# EAGLE design CANoPi (EAGLE 6.3)
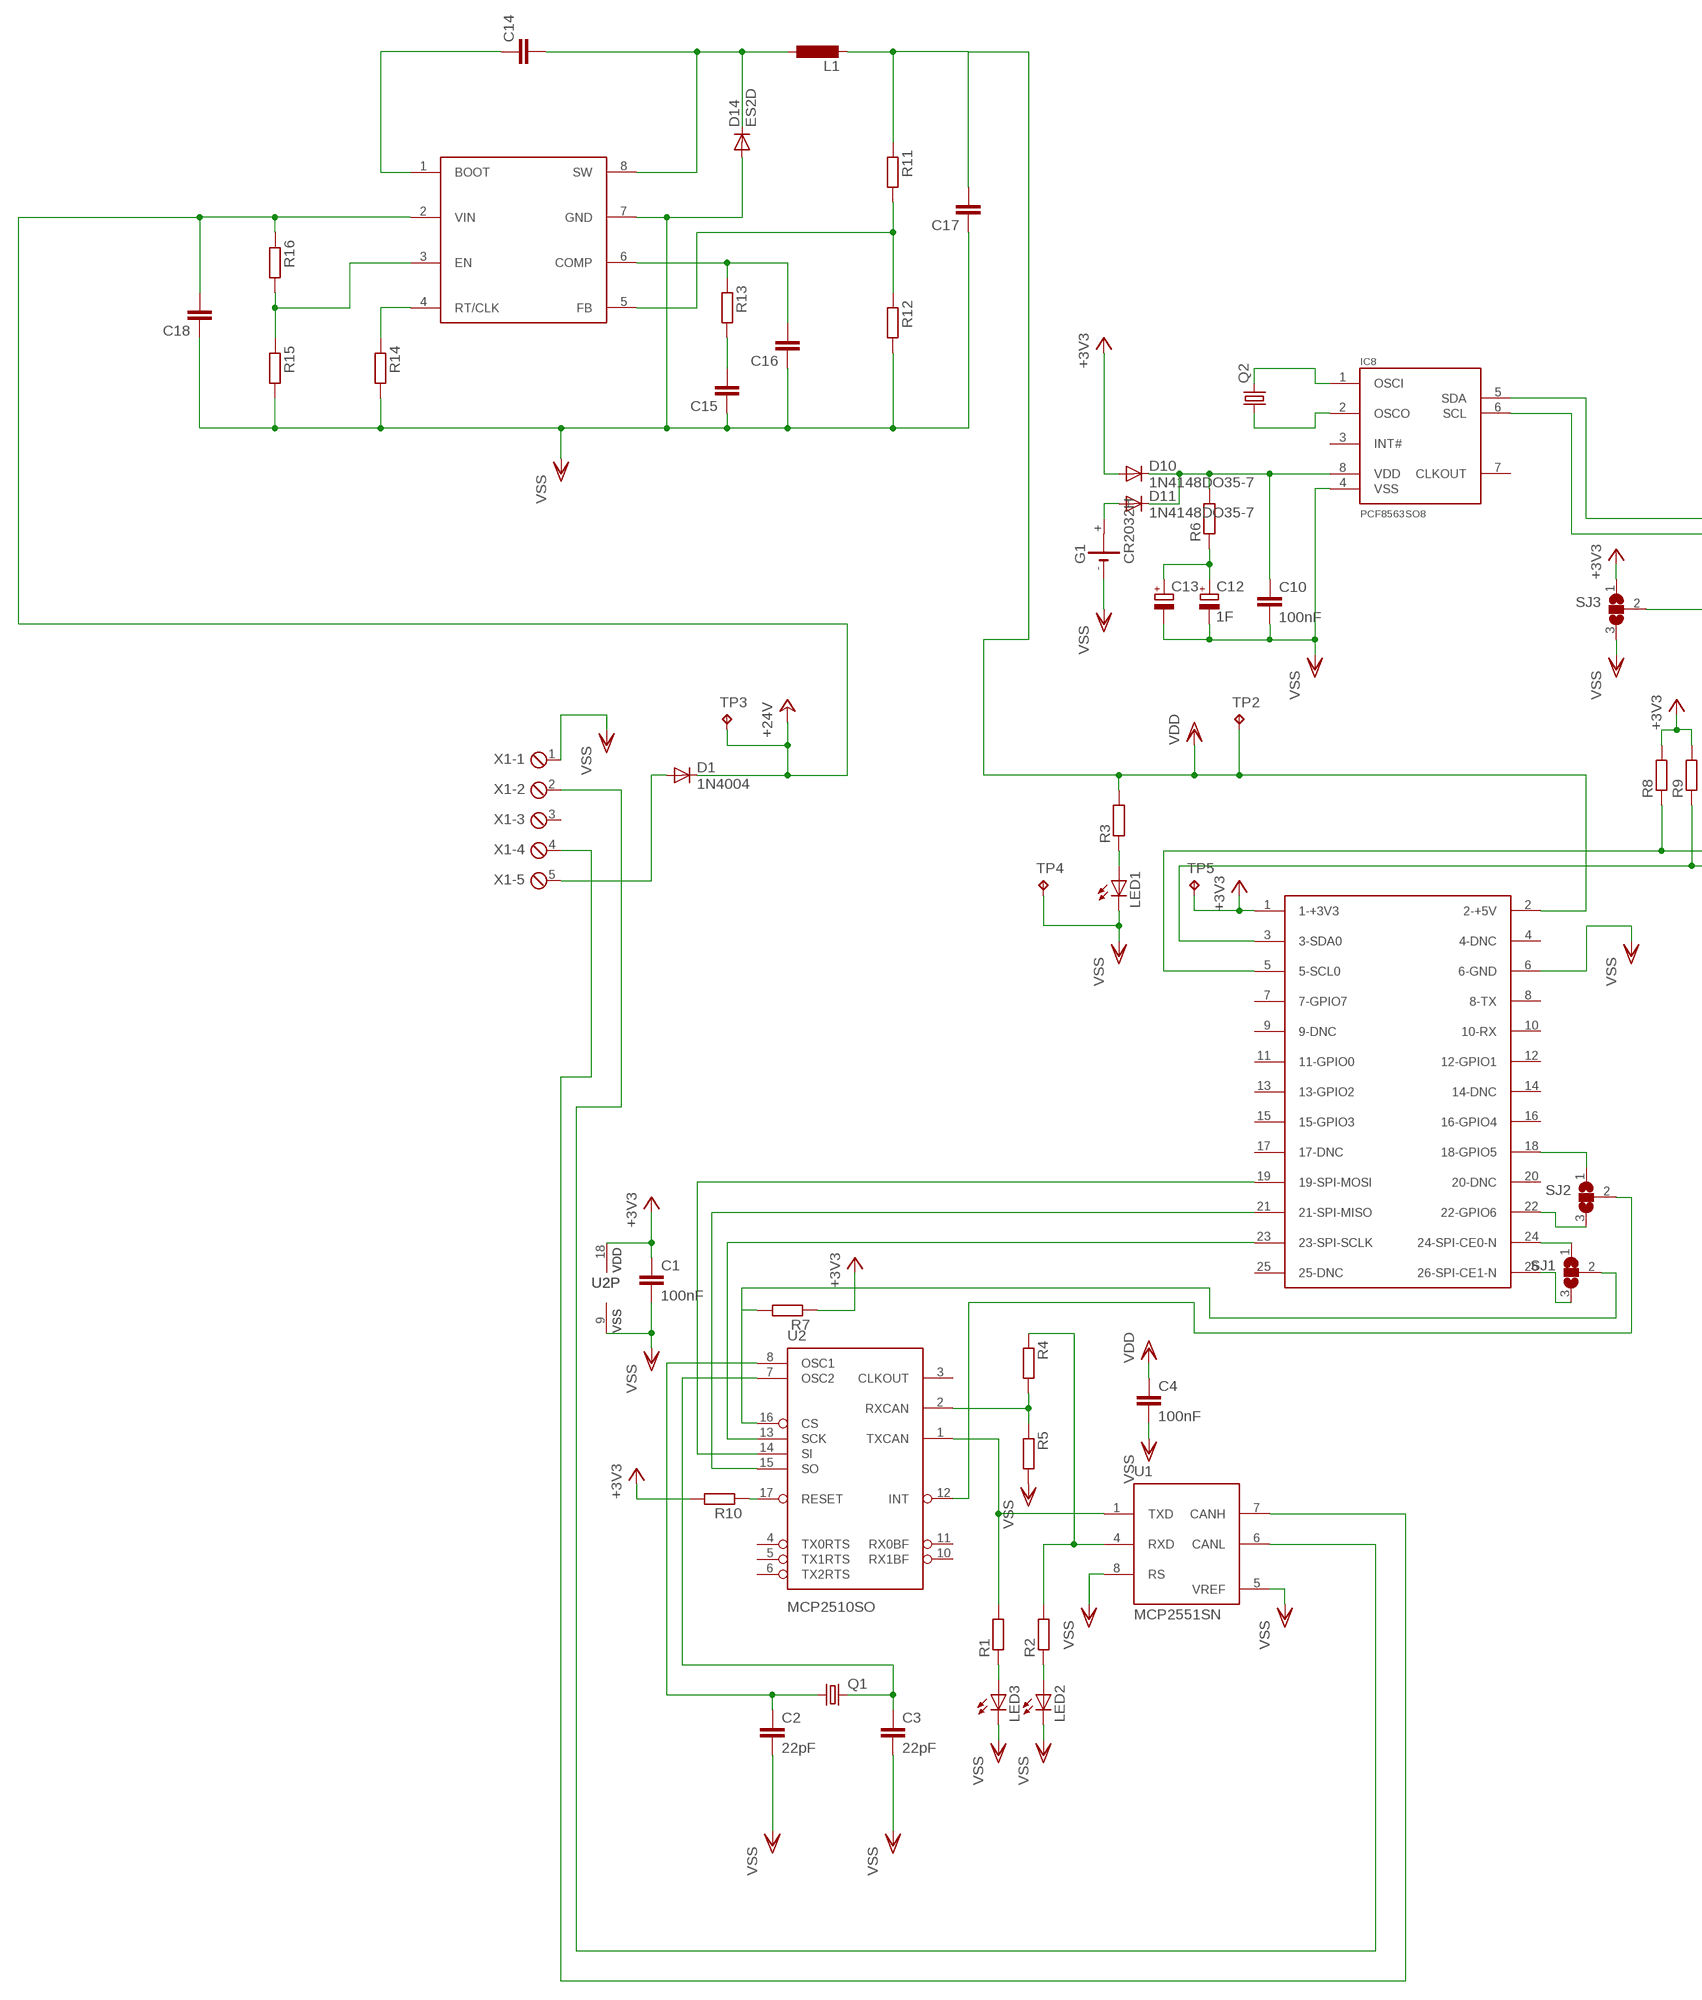
[diagram p0: schematic, sheet 1, part 1 of 2]
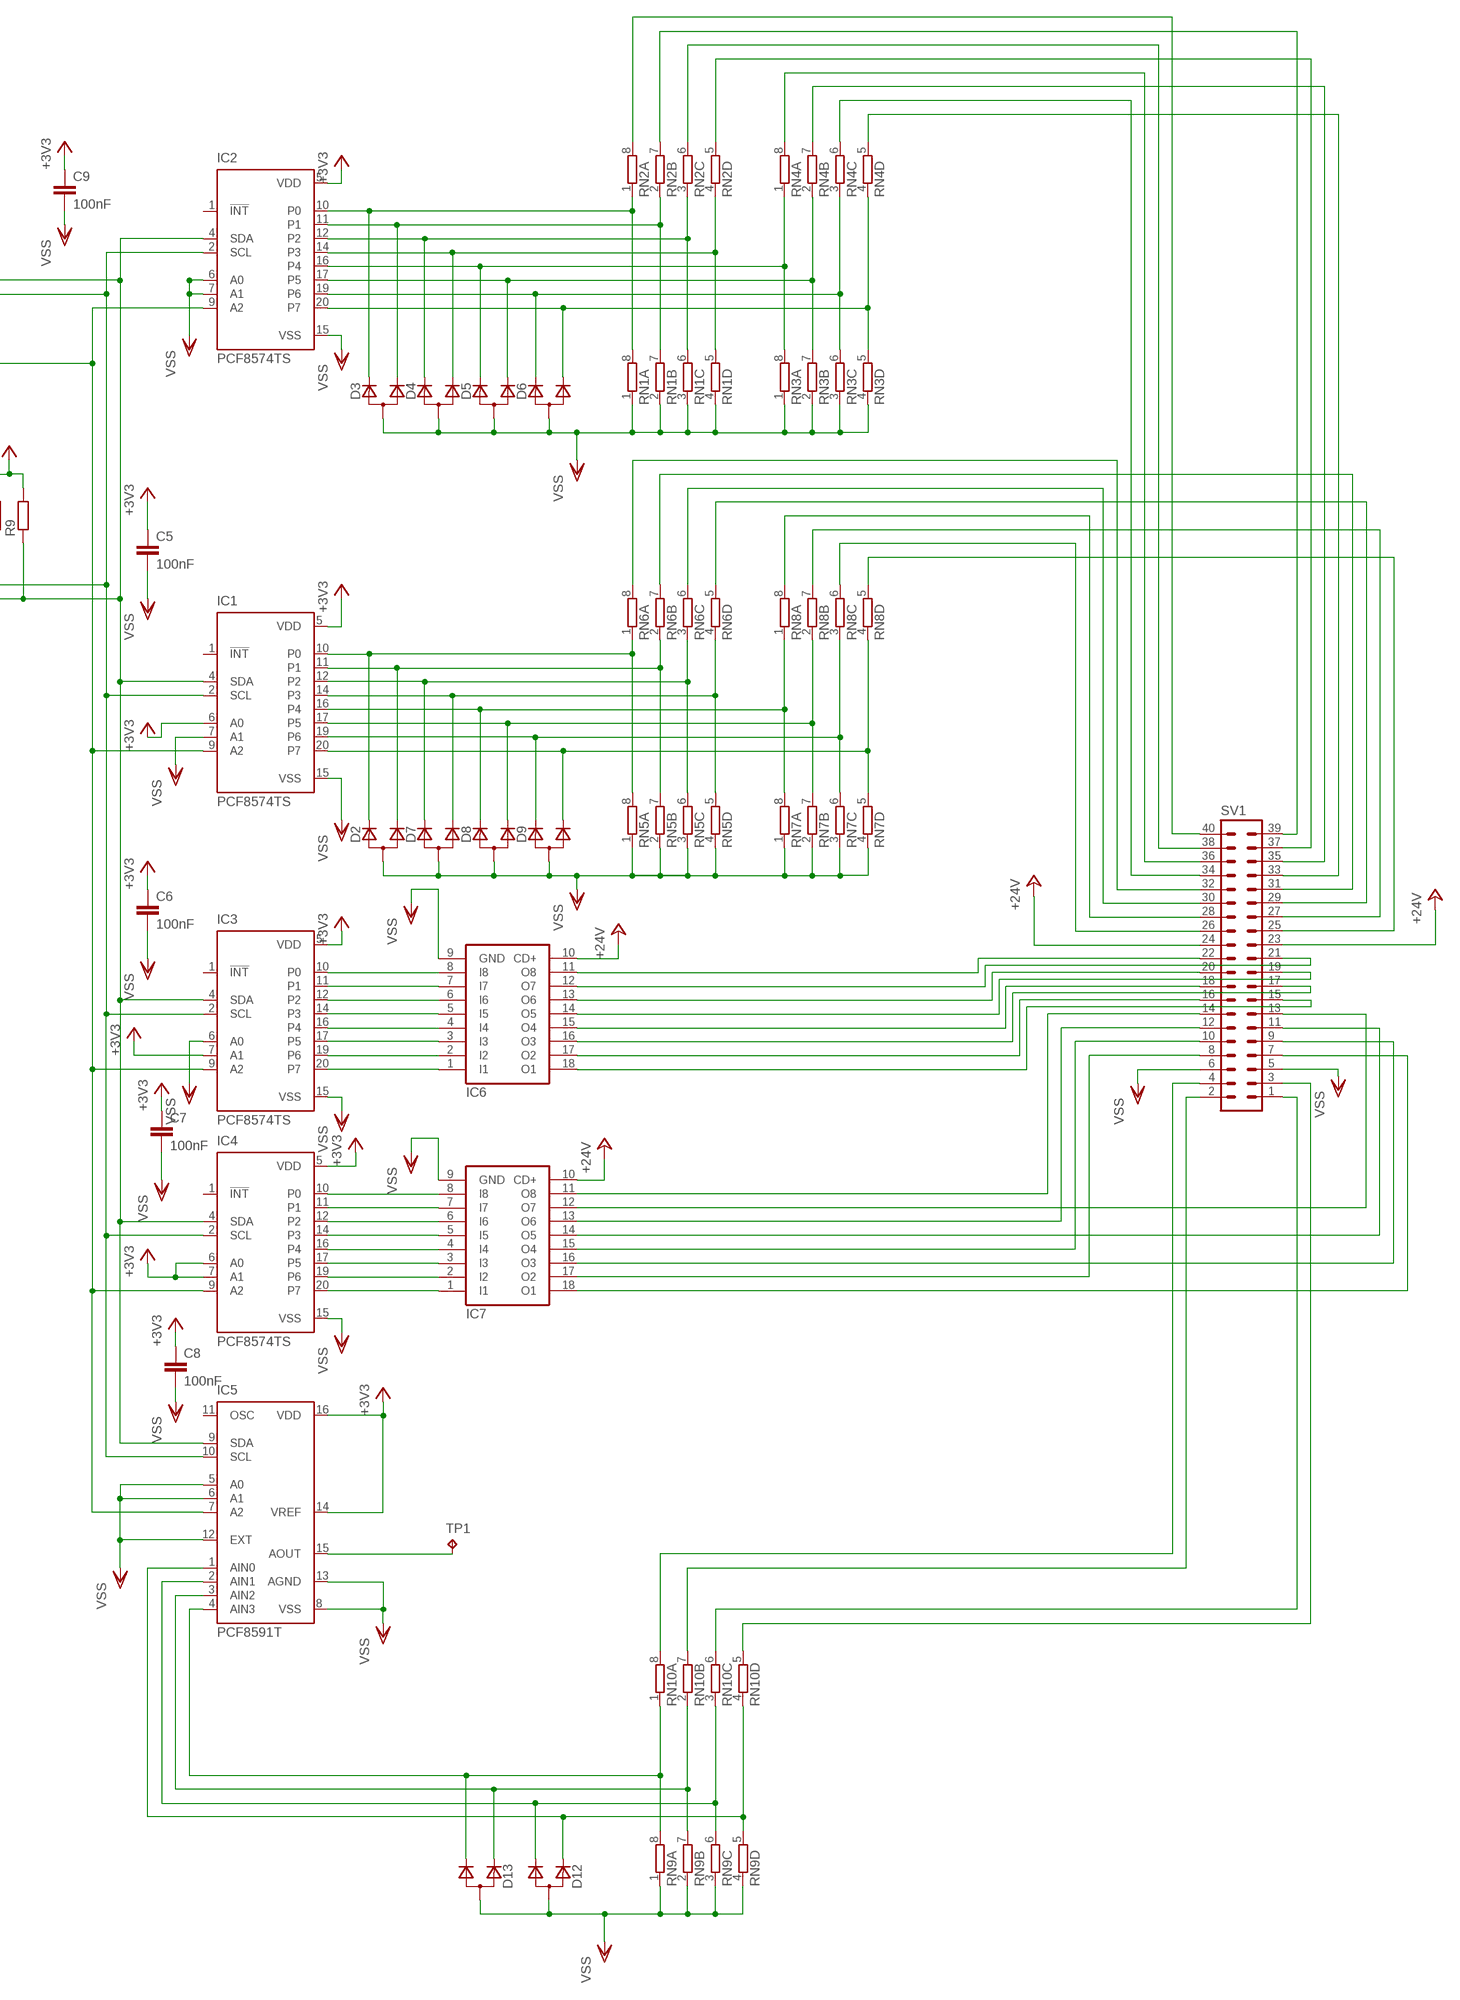
[diagram p1: schematic, sheet 1, part 2 of 2]

## Parts
C1  100nF  C-EUC0603  [C0603]
C2  22pF  C-EUC1206  [C1206]
C3  22pF  C-EUC1206  [C1206]
C4  100nF  C-EUC0603  [C0603]
C5  100nF  C-EUC0603  [C0603]
C6  100nF  C-EUC0603  [C0603]
C7  100nF  C-EUC0603  [C0603]
C8  100nF  C-EUC0603  [C0603]
C9  100nF  C-EUC0603  [C0603]
C10  100nF  C-EUC0603  [C0603]
C12  1F  CPOL-EUCT3216  [CT3216]
C13  CPOL-EUE5-6  [E5-6]
C14  C-EUC0805  [C0805]
C15  C-EUC0805  [C0805]
C16  C-EUC0805  [C0805]
C17  C-EUC1210  [C1210]
C18  C-EUC1210  [C1210]
D1  1N4004  [DO41-10]
D2  D_2CSOT23  [SOT-23]
D3  D_2CSOT23  [SOT-23]
D4  D_2CSOT23  [SOT-23]
D5  D_2CSOT23  [SOT-23]
D6  D_2CSOT23  [SOT-23]
D7  D_2CSOT23  [SOT-23]
D8  D_2CSOT23  [SOT-23]
D9  D_2CSOT23  [SOT-23]
D10  1N4148DO35-7  [DO35-7]
D11  1N4148DO35-7  [DO35-7]
D12  D_2CSOT23  [SOT-23]
D13  D_2CSOT23  [SOT-23]
D14  ES2D  [SMB]
G1  CR2032H  [CR2032H]
IC1  PCF8574TS  [SSOP20]
IC2  PCF8574TS  [SSOP20]
IC3  PCF8574TS  [SSOP20]
IC4  PCF8574TS  [SSOP20]
IC5  PCF8591T  [SO16W]
IC6  ULN2804ASO18W  [SO18W]
IC7  ULN2804ASO18W  [SO18W]
IC8  PCF8563SO8  [SOIC8]
L1  L-EUWE-TPC  [POWER-CHOKE_WE-TPC]
LED1  LEDCHIPLED_1206  [CHIPLED_1206]
LED2  LEDCHIPLED_1206  [CHIPLED_1206]
LED3  LEDCHIPLED_1206  [CHIPLED_1206]
Q1  CRYSTALHC49S  [HC49/S]
Q2  CRYSTALHC49S  [HC49/S]
R1  R-EU_R0805  [R0805]
R2  R-EU_R0805  [R0805]
R3  R-EU_R0805  [R0805]
R4  R-EU_R0805  [R0805]
R5  R-EU_R0805  [R0805]
R6  R-EU_R0805  [R0805]
R7  R-EU_R0805  [R0805]
R8  R-EU_R0805  [R0805]
R9  R-EU_R0805  [R0805]
R10  R-EU_R0805  [R0805]
R11  R-EU_R0805  [R0805]
R12  R-EU_R0805  [R0805]
R13  R-EU_R0805  [R0805]
R14  R-EU_R0805  [R0805]
R15  R-EU_R0805  [R0805]
R16  R-EU_R0805  [R0805]
RN1  4R-NEXBS8V  [EXBS8V]
RN2  4R-NEXBS8V  [EXBS8V]
RN3  4R-NEXBS8V  [EXBS8V]
RN4  4R-NEXBS8V  [EXBS8V]
RN5  4R-NEXBS8V  [EXBS8V]
RN6  4R-NEXBS8V  [EXBS8V]
RN7  4R-NEXBS8V  [EXBS8V]
RN8  4R-NEXBS8V  [EXBS8V]
RN9  4R-NEXBS8V  [EXBS8V]
RN10  4R-NEXBS8V  [EXBS8V]
SJ1  SJ2W  [SJ_2]
SJ2  SJ2W  [SJ_2]
SJ3  SJ2W  [SJ_2]
SV1  ML40L  [ML40L]
TP1  TPPAD1-13  [P1-13]
TP2  TPPAD1-13  [P1-13]
TP3  TPPAD1-13  [P1-13]
TP4  TPPAD1-13  [P1-13]
TP5  TPPAD1-13  [P1-13]
U1  MCP2551SN  [SO-08]
U2  MCP2510SO  [SO-18W]
U$1  RASPBERRY-PI  [RASPBERRY-PI]
U$2  TPS54340  [SO-08]
X1  MPT5  [5POL254]

## Nets
+3V3: C1.1 C5.1 C6.1 C7.1 C8.1 C9.1 D10.A IC1.5(VDD) IC1.6(A0) IC2.5(VDD) IC3.5(VDD) IC3.7(A1) IC4.5(VDD) IC4.6(A0) IC4.7(A1) IC5.14(VREF) IC5.16(VDD) R7.1 R8.2 R9.2 R10.2 SJ3.1 TP5.TP U2.18(VDD) U$1.1(1-+3V3)
+24V: C18.2 D1.C IC6.10(CD+) IC7.10(CD+) R16.1 SV1.23 SV1.24 TP3.TP U$2.2(VIN)
N$2: R1.2 U1.1(TXD) U2.1(TXCAN)
N$3: C2.1 Q1.1 U2.8(OSC1)
N$4: C3.1 Q1.2 U2.7(OSC2)
N$5: LED1.A R3.1
N$6: LED2.A R2.1
N$7: R2.2 R4.1 U1.4(RXD)
N$8: R4.2 R5.1 U2.2(RXCAN)
N$9: LED3.A R1.1
N$10: IC1.4(SDA) IC2.4(SDA) IC3.4(SDA) IC4.4(SDA) IC5.9(SDA) IC8.5(SDA) R9.1 U$1.3(3-SDA0)
N$11: IC1.2(SCL) IC2.2(SCL) IC3.2(SCL) IC4.2(SCL) IC5.10(SCL) IC8.6(SCL) R8.1 U$1.5(5-SCL0)
N$12: SJ2.2 U2.12(INT)
N$13: U2.15(SO) U$1.21(21-SPI-MISO)
N$14: IC3.10(P0) IC6.8(I8)
N$15: IC3.11(P1) IC6.7(I7)
N$16: U2.14(SI) U$1.19(19-SPI-MOSI)
N$17: U2.13(SCK) U$1.23(23-SPI-SCLK)
N$18: R7.2 SJ1.2 U2.16(CS)
N$19: SJ2.3 U$1.22(22-GPIO6)
N$20: IC3.12(P2) IC6.6(I6)
N$21: IC3.14(P3) IC6.5(I5)
N$22: IC3.16(P4) IC6.4(I4)
N$23: IC3.17(P5) IC6.3(I3)
N$24: IC3.19(P6) IC6.2(I2)
N$25: IC3.20(P7) IC6.1(I1)
N$26: IC4.10(P0) IC7.8(I8)
N$27: IC4.11(P1) IC7.7(I7)
N$28: IC4.12(P2) IC7.6(I6)
N$29: IC4.14(P3) IC7.5(I5)
N$30: IC4.16(P4) IC7.4(I4)
N$31: IC4.17(P5) IC7.3(I3)
N$32: IC4.19(P6) IC7.2(I2)
N$33: IC4.20(P7) IC7.1(I1)
N$34: D1.A X1.5
N$36: U1.7(CANH) X1.4
N$37: U1.6(CANL) X1.2
N$39: RN4.7 SV1.35
N$40: RN4.5 SV1.33
N$41: RN4.6 SV1.34
N$42: D3.3(C2) IC2.11(P1) RN1.7 RN2.2
N$43: D4.2(C1) IC2.12(P2) RN1.6 RN2.3
N$44: D4.3(C2) IC2.14(P3) RN1.5 RN2.4
N$45: D5.2(C1) IC2.16(P4) RN3.8 RN4.1
N$46: RN4.8 SV1.36
N$47: D6.2(C1) IC2.19(P6) RN3.6 RN4.3
N$48: D6.3(C2) IC2.20(P7) RN3.5 RN4.4
N$49: D3.2(C1) IC2.10(P0) RN1.8 RN2.1
N$50: RN2.5 SV1.37
N$51: RN2.6 SV1.38
N$52: D5.3(C2) IC2.17(P5) RN3.7 RN4.2
N$53: RN2.7 SV1.39
N$54: IC6.11(O8) SV1.22
N$55: D2.3(C2) IC1.11(P1) RN5.7 RN6.2
N$56: D7.2(C1) IC1.12(P2) RN5.6 RN6.3
N$57: D7.3(C2) IC1.14(P3) RN5.5 RN6.4
N$58: D8.2(C1) IC1.16(P4) RN7.8 RN8.1
N$59: D9.2(C1) IC1.19(P6) RN7.6 RN8.3
N$60: D9.3(C2) IC1.20(P7) RN7.5 RN8.4
N$61: D2.2(C1) IC1.10(P0) RN5.8 RN6.1
N$62: D8.3(C2) IC1.17(P5) RN7.7 RN8.2
N$63: RN8.5 SV1.25
N$64: RN8.6 SV1.26
N$65: RN8.7 SV1.27
N$66: RN8.8 SV1.28
N$67: RN6.5 SV1.29
N$68: RN6.6 SV1.30
N$69: RN6.7 SV1.31
N$70: RN6.8 SV1.32
N$71: IC8.1(OSCI) Q2.2
N$72: IC8.2(OSCO) Q2.1
N$73: D11.A G1.+
N$74: C10.1 D10.C D11.C IC8.8(VDD) R6.2
N$75: C12.+ C13.+ R6.1
N$76: IC5.15(AOUT) TP1.TP
N$77: D12.2(C1) IC5.1(AIN0) RN9.5 RN10.4
N$78: D12.3(C2) IC5.2(AIN1) RN9.6 RN10.3
N$79: IC1.9(A2) IC2.9(A2) IC3.9(A2) IC4.9(A2) IC5.7(A2) SJ3.2
N$80: D13.2(C1) IC5.3(AIN2) RN9.7 RN10.2
N$81: D13.3(C2) IC5.4(AIN3) RN9.8 RN10.1
N$82: SJ1.3 U$1.26(26-SPI-CE1-N)
N$83: SJ1.1 U$1.24(24-SPI-CE0-N)
N$84: SJ2.1 U$1.18(18-GPIO5)
N$85: IC6.12(O7) SV1.21
N$86: IC6.13(O6) SV1.20
N$87: RN10.5 SV1.3
N$88: RN10.6 SV1.1
N$89: RN10.7 SV1.2
N$90: RN10.8 SV1.4
N$91: IC6.14(O5) SV1.19
N$92: IC6.15(O4) SV1.18
N$93: IC6.16(O3) SV1.17
N$94: IC6.17(O2) SV1.16
N$95: IC6.18(O1) SV1.15
N$96: RN2.8 SV1.40
N$97: IC7.11(O8) SV1.14
N$98: IC7.12(O7) SV1.13
N$99: IC7.13(O6) SV1.12
N$100: IC7.14(O5) SV1.11
N$101: IC7.15(O4) SV1.10
N$102: IC7.16(O3) SV1.9
N$103: IC7.17(O2) SV1.8
N$104: IC7.18(O1) SV1.7
N$105: R10.1 U2.17(RESET)
N$107: R15.1 R16.2 U$2.3(EN)
N$108: R14.1 U$2.4(RT/CLK)
N$110: R11.2 R12.1 U$2.5(FB)
N$112: C16.2 R13.1 U$2.6(COMP)
N$115: C15.2 R13.2
N$118: C14.1 U$2.1(BOOT)
N$119: C14.2 D14.C L1.1 U$2.8(SW)
VDD: C4.1 C17.2 L1.2 R3.2 R11.1 TP2.TP U$1.2(2-+5V)
VSS: C1.2 C2.2 C3.2 C4.2 C5.2 C6.2 C7.2 C8.2 C9.2 C10.2 C12.- C13.- C15.1 C16.1 C17.1 C18.1 D2.1(A) D3.1(A) D4.1(A) D5.1(A) D6.1(A) D7.1(A) D8.1(A) D9.1(A) D12.1(A) D13.1(A) D14.A G1.- IC1.7(A1) IC1.15(VSS) IC2.6(A0) IC2.7(A1) IC2.15(VSS) IC3.6(A0) IC3.15(VSS) IC4.15(VSS) IC5.5(A0) IC5.6(A1) IC5.8(VSS) IC5.12(EXT) IC5.13(AGND) IC6.9(GND) IC7.9(GND) IC8.4(VSS) LED1.C LED2.C LED3.C R5.2 R12.2 R14.2 R15.2 RN1.1 RN1.2 RN1.3 RN1.4 RN3.1 RN3.2 RN3.3 RN3.4 RN5.1 RN5.2 RN5.3 RN5.4 RN7.1 RN7.2 RN7.3 RN7.4 RN9.1 RN9.2 RN9.3 RN9.4 SJ3.3 SV1.5 SV1.6 TP4.TP U1.5(VREF) U1.8(RS) U2.9(VSS) U$1.6(6-GND) U$2.7(GND) X1.1
Unconnected: G1.+@1(+) IC1.1(!INT) IC2.1(!INT) IC3.1(!INT) IC4.1(!INT) IC5.11(OSC) IC8.3(INT#) IC8.7(CLKOUT) U2.3(CLKOUT) U2.4(TX0RTS) U2.5(TX1RTS) U2.6(TX2RTS) U2.10(RX1BF) U2.11(RX0BF) U$1.4(4-DNC) U$1.7(7-GPIO7) U$1.8(8-TX) U$1.9(9-DNC) U$1.10(10-RX) U$1.11(11-GPIO0) U$1.12(12-GPIO1) U$1.13(13-GPIO2) U$1.14(14-DNC) U$1.15(15-GPIO3) U$1.16(16-GPIO4) U$1.17(17-DNC) U$1.20(20-DNC) U$1.25(25-DNC) X1.3

## Power pins joined to a net without a drawn wire
VDD: U1.3(VDD)
VSS: U1.2(VSS)

## Library data of the parts
C1-C10 C14-C18 = rcl:C-EU: CAPACITOR, European symbol
C12 C13 = rcl:CPOL-EU: POLARIZED CAPACITOR, European symbol
D1 = diode:1N4004: DIODE general purpose rectifier, 1 A
D2-D9 D12 D13 = zetex:D_2C: Dual DIODE; OC_FARNELL: unknown; OC_NEWARK: unknown
D10 D11 = diode:1N4148: DIODE high speed (Philips)
D14 = diode:ES2D: DIODE super fast rectifier, 2 A
G1 = battery:CR2032H: LI BATTERY Varta
IC1-IC4 = micro-philips:PCF8574: I2C-Bus Remote 8-bit I/O expander http://www.semiconductors.philips.com/acrobat_download/datasheets/PCF8574_4.pdf; MPN: PCF8574TS/3,118; OC_FARNELL: 1506644; OC_NEWARK: 70R6873
IC5 = micro-philips:PCF8591: I2C-Bus D/A CONVERTER; MPN: PCF8591T/2,512; OC_FARNELL: 1826767; OC_NEWARK: 70R6911
IC6 IC7 = uln-udn:ULN2804A: DRIVER ARRAY
IC8 = CEDT:PCF8563
L1 = rcl:L-EU: INDUCTOR, European symbol
LED1-LED3 = led:LED: LED OSRAM: - CHIPLED LG R971, LG N971, LY N971, LG Q971, LY Q971, LO R971, LY R971 LH N974, LH R974 LS Q976, LO Q976, LY Q976 LO Q996 - Hyper CHIPLED LW Q18S LB Q993, LB Q99A, LB R99A - SideLED LS A670, LO A670, LY A670, LG A670, LP A670 LB A673, LV A673, LT A673, LW A673 LH A674 LY A675 LS A676, LA A676, LO A676, LY A676, LW A676 LS A679, LY A679, LG A679 - Hyper Micro SIDELED® LS Y876, LA Y876, LO Y876, LY Y876 LT Y87S - SmartLED LW L88C, LW L88S LB L89C, LB L89S, LG L890 LS L89K, LO L89K, LY L89K LS L896, LA L896, LO L896, LY L896 - TOPLED LS T670, LO T670, LY T670, LG T670, LP T670 LSG T670, LSP T670, LSY T670, LOP T670, LYG T670 LG T671, LOG T671, LSG T671 LB T673, LV T673, LT T673, LW T673 LH T674 LS T676, LA T676, LO T676, LY T676, LB T676, LH T676, LSB T676, LW T676 LB T67C, LV T67C, LT T67C, LS T67K, LO T67K, LY T67K, LW E67C LS E67B, LA E67B, LO E67B, LY E67B, LB E67C, LV E67C, LT E67C LW T67C LS T679, LY T679, LG T679 LS T770, LO T770, LY T770, LG T770, LP T770 LB T773, LV T773, LT T773, LW T773 LH T774 LS E675, LA E675, LY E675, LS T675 LS T776, LA T776, LO T776, LY T776, LB T776 LHGB T686 LT T68C, LB T68C - Hyper Mini TOPLED® LB M676 - Mini TOPLED Santana® LG M470 LS M47K, LO M47K, LY M47K Source: http://www.osram.convergy.de LUXEON: - LUMILED® LXK2-PW12-R00, LXK2-PW12-S00, LXK2-PW14-U00, LXK2-PW14-V00 LXK2-PM12-R00, LXK2-PM12-S00, LXK2-PM14-U00 LXK2-PE12-Q00, LXK2-PE12-R00, LXK2-PE12-S00, LXK2-PE14-T00, LXK2-PE14-U00 LXK2-PB12-K00, LXK2-PB12-L00, LXK2-PB12-M00, LXK2-PB14-N00, LXK2-PB14-P00, LXK2-PB14-Q00 LXK2-PR12-L00, LXK2-PR12-M00, LXK2-PR14-Q00, LXK2-PR14-R00 LXK2-PD12-Q00, LXK2-PD12-R00, LXK2-PD12-S00 LXK2-PH12-R00, LXK2-PH12-S00 LXK2-PL12-P00, LXK2-PL12-Q00, LXK2-PL12-R00 Source: www.luxeon.com KINGBRIGHT: KA-3528ASYC Source: www.kingbright.com
Q1 Q2 = crystal:CRYSTAL: CRYSTAL; OC_FARNELL: 1667008; OC_NEWARK: unknown
R1-R16 = rcl:R-EU_: RESISTOR, European symbol
RN1-RN10 = resistor-dil:4R-N: Array Chip Resistor Source: RS Component / Phycomp; OC_FARNELL: unknown; OC_NEWARK: unknown
SJ1-SJ3 = jumper:SJ2W: SMD solder JUMPER
SV1 = con-harting-ml:ML40: HARTING; OC_FARNELL: unknown; OC_NEWARK: unknown
TP1-TP5 = testpad:TP: Test pad
U1 = microchip_can:MCP2551: High Speed CAN tranceiver
U2 = microchip_can:MCP2510
U$1 = RaspberryPi:RASPBERRY-PI: Raspberry Pi Board <http://www.raspberrypi.org/> Jacques Lagnel V1.0 (beta) 2012 Board dimension: Forum 3D model <http://www.raspberrypi.org/forum/general-discussion/mechanical-profile-3d-models?value=3d%20model&type=1&include=1&search=1&ret=all> The GPIO Connector (P1): http://elinux.org/RPi_Low-level_peripherals
U$2 = texas:TPS54340: 42 V Input, 3.5 A, Step Down DC-DC Converter
X1 = con-phoenix-254:MPT5: PHOENIX CONNECTOR; OC_FARNELL: unknown; OC_NEWARK: unknown

## Board
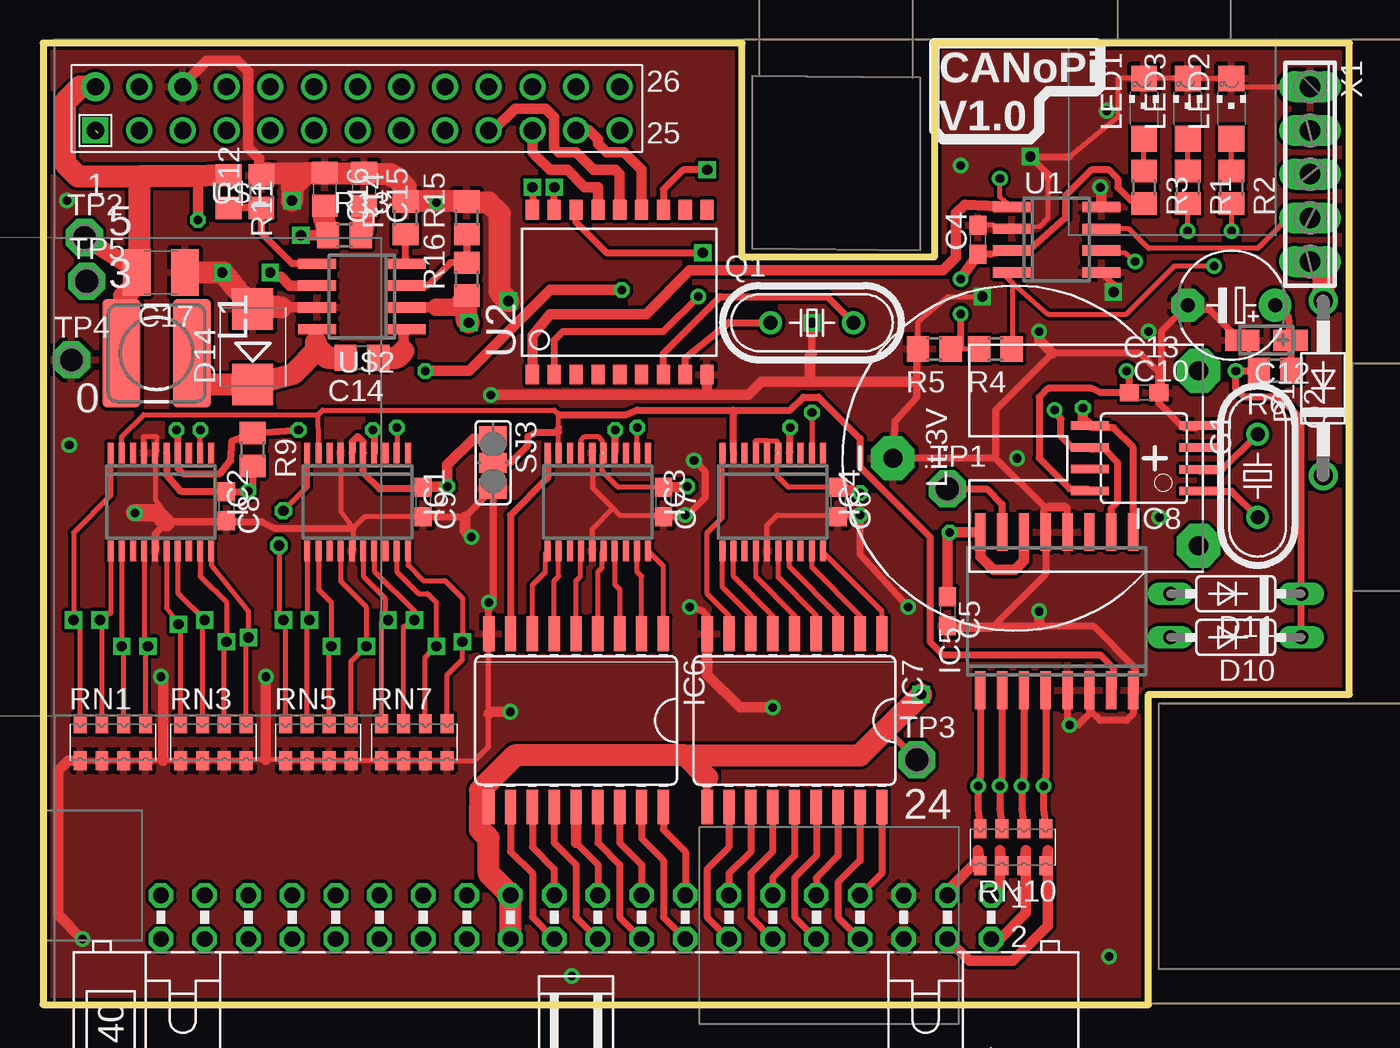
[diagram p2: board, top side]
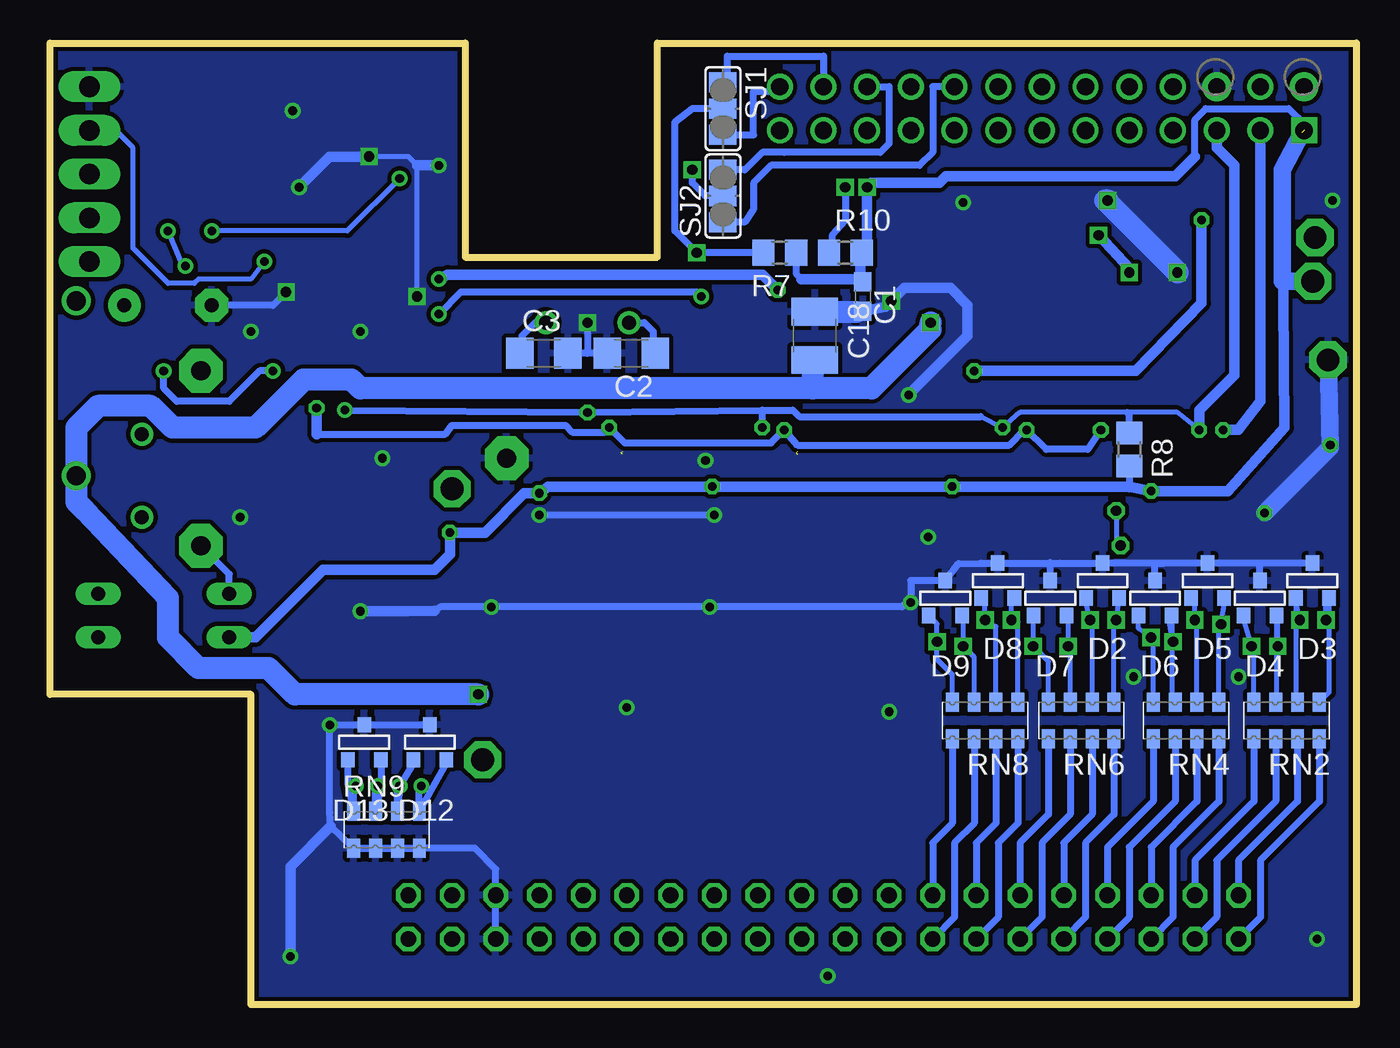
[diagram p3: board, bottom side, seen from below]

Size 75.95 x 55.88 mm. Coordinates in mm from the lower left corner, seen from the top.
Outline: 0,55.88 0,0 64.26,0 64.26,18.03 75.95,18.03 75.95,55.88 51.82,55.88 51.82,43.43 40.64,43.43 40.64,55.88 0,55.88
Copper layers (1*16): Top 0.035mm / dielectric 1.5mm / Bottom 0.035mm
Design rules "dipole_elec": minimum track width 0.2mm, minimum drill 0.3mm, track to track 0.2mm, track to pad 0.2mm, pad to pad 0.2mm, via to via 0.2mm, smd to smd 0.2mm, copper to edge 0.2mm, drill to drill 0.2mm, minimum pad ring 10mil, minimum via ring 8mil, stop-mask expansion 4mil, vias tented up to drill 0mil, thermal gap 10mil

### Footprints (pad centres in the part's own frame; a part is rotated, then mirrored left to right if it is on the bottom)
C0603 = smd 1.1 x 1: 1 -0.85,0; 2 0.85,0
C1206 = smd 1.6 x 1.8: 1 -1.4,0; 2 1.4,0
CT3216 = smd 2 x 1.2: + -1.4,0; - 1.4,0
E5-6 = drill 0.813 pad 1.905: + -2.54,0 | drill 0.813 pad 1.905 octagon: - 2.54,0
C0805 = smd 1.3 x 1.5: 1 -0.95,0; 2 0.95,0
C1210 = smd 1.6 x 2.7: 1 -1.4,0; 2 1.4,0
DO41-10 = drill 1.118: A 5.08,0; C -5.08,0
SOT-23 = smd 0.787 x 0.889: 1 0.025,-1.016; 2 -0.94,1.016; 3 0.991,1.016
DO35-7 = drill 0.813 long: A 3.81,0; C -3.81,0
SMB = smd 2.4 x 2.4: A 2.2,0; C -2.2,0
CR2032H = drill 1.118 pad 2.54 octagon: + 5.08,10.795; +@1 -5.08,10.795; - 0,-6.985
SSOP20 = smd 0.35 x 1.2: 1 -2.925,-2.85; 2 -2.275,-2.85; 3 -1.625,-2.85; 4 -0.975,-2.85; 5 -0.325,-2.85; 6 0.325,-2.85; 7 0.975,-2.85; 8 1.625,-2.85; 9 2.275,-2.85; 10 2.925,-2.85; 11 2.925,2.85; 12 2.275,2.85; 13 1.625,2.85; 14 0.975,2.85; 15 0.325,2.85; 16 -0.325,2.85; 17 -0.975,2.85; 18 -1.625,2.85; 19 -2.275,2.85; 20 -2.925,2.85
SO16W = smd 0.6 x 2.2: 1 -4.445,-4.6; 2 -3.175,-4.6; 3 -1.905,-4.6; 4 -0.635,-4.6; 5 0.635,-4.6; 6 1.905,-4.6; 7 3.175,-4.6; 8 4.445,-4.6; 9 4.445,4.6; 10 3.175,4.6; 11 1.905,4.6; 12 0.635,4.6; 13 -0.635,4.6; 14 -1.905,4.6; 15 -3.175,4.6; 16 -4.445,4.6
SO18W = smd 0.66 x 2.032: 1 -5.08,-5.029; 2 -3.81,-5.029; 3 -2.54,-5.029; 4 -1.27,-5.029; 5 0,-5.029; 6 1.27,-5.029; 7 2.54,-5.029; 8 3.81,-5.029; 9 5.08,-5.029; 10 5.08,5.029; 11 3.81,5.029; 12 2.54,5.029; 13 1.27,5.029; 14 0,5.029; 15 -1.27,5.029; 16 -2.54,5.029; 17 -3.81,5.029; 18 -5.08,5.029
SOIC8 = smd 0.5 x 2.2: 1 -1.905,-3.154; 2 -0.645,-3.154; 3 0.625,-3.154; 4 1.895,-3.154; 5 1.905,3.154; 6 0.635,3.154; 7 -0.635,3.154; 8 -1.905,3.154
POWER-CHOKE_WE-TPC = smd 6.3 x 2.2: 1 0,2.05; 2 0,-2.05
CHIPLED_1206 = smd 1.5 x 1.5: A 0,-1.75; C 0,1.75
HC49/S = drill 0.813: 1 -2.413,0; 2 2.413,0
R0805 = smd 1.3 x 1.5: 1 -0.95,0; 2 0.95,0
EXBS8V = smd 0.75 x 1.1: 1 -1.905,-1.07; 2 -0.635,-1.07; 3 0.635,-1.07; 4 1.905,-1.07; 5 1.905,1.07; 6 0.635,1.07; 7 -0.635,1.07; 8 -1.905,1.07
SJ_2 = smd 1.168 x 1.6: 1 -1.524,0; 2 0,0; 3 1.524,0
ML40L = drill 0.914 octagon: 1 -24.13,-1.27; 2 -24.13,1.27; 3 -21.59,-1.27; 4 -21.59,1.27; 5 -19.05,-1.27; 6 -19.05,1.27; 7 -16.51,-1.27; 8 -16.51,1.27; 9 -13.97,-1.27; 10 -13.97,1.27; 11 -11.43,-1.27; 12 -11.43,1.27; 13 -8.89,-1.27; 14 -8.89,1.27; 15 -6.35,-1.27; 16 -6.35,1.27; 17 -3.81,-1.27; 18 -3.81,1.27; 19 -1.27,-1.27; 20 -1.27,1.27; 21 1.27,-1.27; 22 1.27,1.27; 23 3.81,-1.27; 24 3.81,1.27; 25 6.35,-1.27; 26 6.35,1.27; 27 8.89,-1.27; 28 8.89,1.27; 29 11.43,-1.27; 30 11.43,1.27; 31 13.97,-1.27; 32 13.97,1.27; 33 16.51,-1.27; 34 16.51,1.27; 35 19.05,-1.27; 36 19.05,1.27; 37 21.59,-1.27; 38 21.59,1.27; 39 24.13,-1.27; 40 24.13,1.27
P1-13 = drill 1.321 pad 2.159 octagon: TP 0,0
SO-08 = smd 0.6 x 2.2: 1 -1.905,-2.6; 2 -0.635,-2.6; 3 0.635,-2.6; 4 1.905,-2.6; 5 1.905,2.6; 6 0.635,2.6; 7 -0.635,2.6; 8 -1.905,2.6
SO-18W = smd 0.762 x 1.143: 1 -5.08,-4.788; 2 -3.81,-4.788; 3 -2.54,-4.788; 4 -1.27,-4.788; 5 0,-4.788; 6 1.27,-4.788; 7 2.54,-4.788; 8 3.81,-4.788; 9 5.08,-4.788; 10 5.08,4.788; 11 3.81,4.788; 12 2.54,4.788; 13 1.27,4.788; 14 0,4.788; 15 -1.27,4.788; 16 -2.54,4.788; 17 -3.81,4.788; 18 -5.08,4.788
RASPBERRY-PI = drill 1 square: 1 0,0 | drill 1 pad 1.676: 2 0,2.54; 6 5.08,2.54 | drill 1: 3 2.54,0; 4 2.54,2.54; 5 5.08,0; 7 7.62,0; 8 7.62,2.54; 9 10.16,0; 10 10.16,2.54; 11 12.7,0; 12 12.7,2.54; 13 15.24,0; 14 15.24,2.54; 15 17.78,0; 16 17.78,2.54; 17 20.32,0; 18 20.32,2.54; 19 22.86,0; 20 22.86,2.54; 21 25.4,0; 22 25.4,2.54; 23 27.94,0; 24 27.94,2.54; 25 30.48,0; 26 30.48,2.54
5POL254 = drill 1.2 long: 1 -5.08,0; 2 -2.54,0; 3 0,0; 4 2.54,0; 5 5.08,0

### Placement (x,y rotation side)
C1  28.7,41.15 270 bottom
C2  42.16,37.85 180 bottom
C3  47.24,37.85 0 bottom
C4  54.36,44.45 90 top
C5  52.58,22.86 270 top
C6  46.23,29.21 270 top
C7  36.07,29.21 270 top
C8  10.67,28.96 270 top
C9  22.1,29.21 270 top
C10  64.01,35.56 0 top
C12  71.12,38.61 180 top
C13  69.09,40.64 180 top
C14  18.54,37.59 180 top
C15  18.67,47.37 270 top
C16  16.38,47.37 270 top
C17  6.86,42.55 180 top
C18  31.5,38.86 270 bottom
D1  74.42,35.81 90 top
D2  14.73,24.64 180 bottom
D3  2.54,24.64 180 bottom
D4  5.59,23.62 180 bottom
D5  8.64,24.64 180 bottom
D6  11.68,23.62 180 bottom
D7  17.78,23.62 180 bottom
D8  20.83,24.64 180 bottom
D9  23.88,23.62 180 bottom
D10  69.34,21.34 180 top
D11  69.34,23.88 180 top
D12  53.85,15.24 180 bottom
D13  57.66,15.24 180 bottom
D14  12.19,38.23 90 top
G1  56.39,31.75 270 top
IC1  18.29,29.21 180 top
IC2  6.86,29.21 180 top
IC3  32.26,29.21 180 top
IC4  42.42,29.21 180 top
IC5  58.93,22.86 0 top
IC6  30.99,16.51 180 top
IC7  43.69,16.51 180 top
IC8  64.01,31.75 90 top
L1  6.6,37.85 270 top
LED1  64.01,52.07 0 top
LED2  69.09,52.07 0 top
LED3  66.55,52.07 0 top
Q1  44.7,39.62 0 top
Q2  70.61,30.73 270 top
R1  66.55,47.5 270 top
R2  69.09,47.5 270 top
R3  64.01,47.5 270 top
R4  55.37,38.1 180 top
R5  51.82,38.1 180 top
R6  71.63,36.83 180 top
R7  33.53,43.69 180 bottom
R8  13.21,32.26 270 bottom
R9  12.19,32.26 270 top
R10  29.72,43.69 0 bottom
R11  10.8,47.24 270 top
R12  12.7,47.24 90 top
R13  17.53,44.7 0 top
R14  21.08,45.72 90 top
R15  24.64,45.72 90 top
R16  24.64,42.16 90 top
RN1  4.06,15.24 0 top
RN2  4.06,16.51 180 bottom
RN3  9.91,15.24 0 top
RN4  9.91,16.51 180 bottom
RN5  16,15.24 0 top
RN6  16,16.51 180 bottom
RN7  21.59,15.24 0 top
RN8  21.59,16.51 180 bottom
RN9  56.39,10.16 0 bottom
RN10  56.39,9.14 180 top
SJ1  36.83,52.07 270 bottom
SJ2  36.83,46.99 90 bottom
SJ3  26.16,31.5 270 top
SV1  30.99,5.08 180 top
TP1  52.58,29.97 0 top
TP2  2.41,44.58 0 top
TP3  50.8,14.22 0 top
TP4  1.65,37.47 0 top
TP5  2.54,42.04 0 top
U1  58.93,44.45 270 top
U2  33.53,41.4 0 top
U$1  3.05,50.8 0 top
U$2  18.54,41.15 90 top
X1  73.66,48.26 270 top

### Tracks (layer width: path | path; a pad name or v marks a point on that pad's centre or on a via)
+3V3  (via drill 0.5, 0.6)  (5 unrouted)
  Top 0.305: C6.1 43.35,30.06 42.67,30.73 42.67,31.99 | C7.1 33.44,30.06 32.51,30.99 32.51,31.99 | 42.16,32.77 42.67,32.77 42.67,32.13 | IC4.6 42.09,32.7 42.16,32.77 | 42.16,32.77 41.4,32.77 41.4,32.1 IC4.7 | IC3.7 31.28,32.81 31.5,33.02 32.26,33.02 32.51,32.77 32.51,32.13
  Top 0.406: C9.1 22.01,29.97 19.56,29.97 18.61,30.92 IC1.5 18.61,32.7 18.29,33.02 17.96,32.7 IC1.6 | 66.04,21.34 D10.A | v28.45,47.5 28.49,46.23 U2.18 | IC2.5 7.18,30.79 8,29.84 10.76,29.84 C8.1 11.52,29.81 v11.94,29.84 12.19,30.1 R9.2
  Top 0.61: C9.1 22.14,30.1 v23.49,30.1 23.49,31.37 25.02,32.89 26.03,32.89 SJ3.1 | C7.1 37.43,30.06 v37.47,30.1 | v47.5,29.72 46.27,30.1 C6.1 | C5.1 52.58,27.3 v52.7,27.43 52.73,27.46 IC5.16 54.48,26.04 55.25,25.27 56.52,25.27 57.02,25.78 IC5.14
  Bottom 0.406: v28.45,47.5 28.51,44.38 R10.2 28.77,42.83 C1.1 28.66,42.16 28.7,42.16 | R7.1 32.58,42.48 32.26,42.16 | R8.2 13.21,30.1 13.21,29.97 | 9.4,49.28 9.4,51.44 8.76,52.07 3.94,52.07 3.05,51.18
  Bottom 0.61: 4.32,48.51 4.19,33.53 7.49,29.84 v11.94,29.84 13.21,30.1 v23.49,30.1 v37.47,30.1 46.99,30.1 v47.5,29.72 48.39,29.72 50.67,27.43 v52.7,27.43 52.7,26.16 53.59,25.27 60.07,25.27 64.01,21.34 D10.A | 32.26,42.16 28.7,42.16 28.83,42.29 28.83,43.69 28.45,44.07 v28.45,47.5 28.19,47.75 24.26,47.75 23.88,48.13 10.54,48.13 9.4,49.28 | 3.05,51.18 U$1.1
  Bottom 1.016: TP5.TP 4.32,42.04 4.32,48.51 3.18,50.67
+24V  (via drill 0.6)
  Top 0.406: IC6.10 25.45,11.48 | IC7.10 38.61,13.21 | TP3.TP 49.15,15.88 48.89,15.88
  Top 0.61: 22.86,40.51 U$2.2
  Top 1.016: R16.1 23.94,40.51 22.86,40.51
  Top 1.27: SV1.24 SV1.23 25.91,7.62 25.91,9.65 25.4,10.16 25.4,11.43 | 25.4,11.43 25.45,11.48 | 38.61,13.21 37.34,14.48 | 37.34,14.48 27.43,14.48 25.4,12.45 25.4,11.43 | 37.34,14.48 47.5,14.48 48.89,15.88 v51.05,18.03 | v24.77,39.62 24.64,39.75 R16.1
  Bottom 1.27: v51.05,18.03 61.72,18.03 63.25,19.56 67.31,19.56 69.09,21.34 69.09,23.62 73.91,28.7 74.42,29.21 D1.C 74.42,33.53 73.15,34.8 70.1,34.8 68.83,33.53 64.01,33.53 61.21,36.32 58.42,36.32 57.91,35.81 31.62,35.81 | 31.62,35.81 28.19,35.81 24.77,39.24 v24.77,39.62 | C18.2 31.62,37.34 31.62,35.81
N$2  (via drill 0.5 pad 0.25)
  Top 0.305: U1.1 55.63,46.92 v55.63,48.01 | v66.55,44.96 R1.2
  Top 0.61: U2.1 28.45,38.86 29.46,40.13 35.05,40.13 37.59,42.67 52.32,42.67 53.09,43.43 53.09,45.97 53.59,46.48 U1.1
  Bottom 0.305: v55.63,48.01 58.67,44.96 v66.55,44.96
N$3
  Top 0.406: U2.8 37.34,37.59 39.88,39.62 Q1.1
  Bottom 0.406: Q1.1 41.4,39.62 40.89,39.12 40.89,37.98 C2.1
N$4
  Top 0.406: U2.7 36.07,37.85 39.37,41.15 45.59,41.15 Q1.2
  Bottom 0.406: Q1.2 47.75,39.62 48.51,38.86 48.51,37.98 C3.1
N$5
  Top 0.305: R3.1 LED1.A
N$6
  Top 0.305: R2.1 LED2.A
N$7  (via drill 0.5 pad 0.25)
  Top 0.305: R4.1 56.39,38.17 56.39,41.91 | 55.63,42.42 55.88,42.42 56.39,41.91 | 55.63,42.42 55.5,42.55 U1.4 55.63,42.42 | 56.39,41.91 58.42,40.13 62.99,40.13 65.79,42.93 v68.07,42.93 | R2.2 v69.09,44.96
  Bottom 0.305: v68.07,42.93 68.33,43.18 v69.09,44.96
N$8  (via drill 0.5 pad 0.25)
  Top 0.305: R5.1 53.34,38.1 R4.2
  Top 0.406: v38.1,41.15 36.07,39.12 30.23,39.12 29.72,38.61 U2.2 | v53.34,40.13 53.34,38.1
  Bottom 0.406: v38.1,41.15 38.35,41.4 52.07,41.4 v53.34,40.13
N$9
  Top 0.305: R1.1 LED3.A
N$10  (via drill 0.5)
  Top 0.406: IC5.9 63.37,32.38 62.23,33.53 60.98,33.53 IC8.5 | 7.75,33.27 7.83,33.19 IC2.4 7.83,31.16 8.13,30.86 10.29,30.86 10.92,31.62 10.98,32.77 R9.1 14.16,33.34 v14.86,33.4 | v19.18,33.4 19.26,33.31 IC1.4 | v43.43,33.53 43.39,33.36 IC4.4 43.43,32.1 v43.43,33.53 | v33.27,33.4 33.23,33.23 IC3.4 33.27,32.1 v33.27,33.4
  Top 0.61: v7.75,33.4 7.75,33.27 | IC8.5 60.45,34.06 v60.45,34.67
  Bottom 0.406: 60.45,33.15 52.96,33.15 52.58,33.66 45.97,33.66 45.59,33.27 43.69,33.27 v43.43,33.53 42.55,32.64 34.04,32.64 v33.27,33.4 33.15,33.27 32.51,32.51 20.19,32.51 19.3,33.4 v19.18,33.4 18.03,32.26 15.62,32.26 v14.86,33.4
  Bottom 0.61: U$1.3 5.59,35.05 6.86,33.4 v7.75,33.4 | v60.45,34.67 60.45,33.15
N$11  (via drill 0.5 pad 0.25)
  Top 0.305: v44.7,34.42 IC4.2 | IC3.2 34.53,33.26 v34.54,33.53 | v20.57,33.53 20.57,32.07 IC1.2 | IC2.2 9.13,33.01 v9.14,33.4
  Top 0.406: IC5.10 62.1,28.83 62.48,29.21 62.48,31.5 61.72,32.26 60.98,32.26 IC8.6 59.82,32.38 59.18,33.02 59.18,34.04 v58.8,34.54
  Bottom 0.305: 21.84,34.16 v20.57,33.53 19.56,34.42 13.34,34.42 10.41,34.42 v9.14,33.4
  Bottom 0.406: 34.54,34.54 v44.7,34.42 v58.8,34.54 | 34.54,34.54 32.77,34.54 32.38,34.16 21.84,34.16 | R8.1 13.21,34.29 13.34,34.42 | v34.54,33.53 34.54,34.54
  Bottom 0.61: v9.14,33.4 9.14,34.54 7.11,36.58 7.11,48.77 8.13,49.78 U$1.5
N$12  (via drill 0.6)
  Top 0.406: v38.61,48.51 37.21,48.51 36.07,47.37 U2.12
  Bottom 0.406: SJ2.2 37.85,46.99 38.61,47.75 v38.61,48.51
N$13
  Top 0.61: U2.15 32.26,47.5 31.5,47.5 30.48,48.51 29.46,48.51 28.7,49.28 28.45,49.53 U$1.21
N$14
  Top 0.406: IC3.10 29.33,30.6 27.18,28.45 IC6.8
N$15
  Top 0.305: IC6.7 28.45,24.38 29.21,25.15 29.21,26.24 IC3.11
N$16
  Top 0.61: U2.14 33.53,47.75 33.53,48.26 33.27,48.51 32,48.51 30.99,49.53 29.97,49.53 29.72,49.78 29.72,51.56 29.21,52.07 27.43,52.07 26.16,50.8 U$1.19
N$17
  Top 0.61: U2.13 34.8,48.51 34.04,49.28 33.78,49.53 32.77,49.53 32.26,50.04 32.26,50.29 31.75,50.8 U$1.23
N$18  (via drill 0.6)
  Top 0.406: 30.99,46.23 U2.16 30.99,45.47 32.77,43.69 v38.35,43.69
  Bottom 0.406: SJ1.2 38.61,52.07 39.62,51.27 | R7.2 v38.35,43.69 39.62,44.96 39.62,51.27 | 39.62,51.27 39.46,51.43
N$19
  Bottom 0.406: U$1.22 27.18,53.34 27.18,50.04 27.69,49.53 33.27,49.53 34.54,49.53 35.56,48.51 SJ2.3
N$20
  Top 0.305: IC6.6 29.72,24.64 29.97,24.89 29.97,26.35 IC3.12
N$21
  Top 0.305: IC6.5 30.99,24.64 31.24,24.89 31.24,26.32 IC3.14
N$22
  Top 0.305: IC6.4 32.26,25.15 32.51,25.4 32.51,26.29 IC3.16
N$23
  Top 0.305: IC3.17 33.23,24.43 33.53,24.13 IC6.3
N$24
  Top 0.305: IC6.2 34.8,24.89 34.54,25.15 IC3.19
N$25
  Top 0.305: IC6.1 36.07,25.48 IC3.20
N$26
  Top 0.305: IC7.8 39.88,22.61 38.61,23.88 38.61,27.43 39.49,28.32 IC4.10
N$27
  Top 0.305: IC7.7 41.15,22.61 39.49,24.26 IC4.11
N$28
  Top 0.305: IC7.6 42.42,22.61 40.14,24.88 IC4.12
N$29
  Top 0.305: IC7.5 43.69,22.61 41.44,24.85 IC4.14
N$30
  Top 0.305: IC7.4 44.96,22.61 42.74,24.82 IC4.16
N$31
  Top 0.305: IC7.3 46.23,22.61 43.39,25.44 IC4.17
N$32
  Top 0.305: IC7.2 47.5,22.61 44.69,25.41 IC4.19
N$33
  Top 0.305: IC7.1 48.77,22.86 45.34,26.29 IC4.20
N$34
  Top 1.27: X1.5 74.42,42.42 D1.A
N$36
  Top 0.305: X1.4 72.39,45.72 70.61,43.94 64.26,43.94 63.12,45.09 U1.7
N$37  (via drill 0.5 pad 0.25)
  Top 0.305: U1.6 62.92,43.69 v63.5,43.18
  Bottom 0.305: v63.5,43.18 64.26,42.16 67.31,42.16 67.56,41.91 69.09,41.91 71.12,43.94 71.12,49.78 72.14,50.8 X1.2
N$39
  Bottom 0.406: RN4.7 9.27,11.81 11.94,9.14 SV1.35
N$40
  Bottom 0.406: RN4.5 11.81,11.81 14.48,9.14 SV1.33
N$41
  Bottom 0.406: RN4.6 10.54,11.81 13.21,9.14 13.21,5.08 SV1.34
N$42  (via drill 0.6)
  Top 0.305: IC2.11 3.93,22.73 v3.3,22.35 3.43,22.23 RN1.7
  Bottom 0.305: v3.3,22.35 3.56,23.6 D3.3 3.53,17.68 RN2.2
N$43  (via drill 0.6)
  Top 0.305: IC2.12 4.58,20.84 v4.57,20.83 4.7,20.7 RN1.6
  Bottom 0.305: v4.57,20.83 4.57,22.53 D4.2 4.65,17.63 RN2.3
N$44  (via drill 0.6)
  Top 0.305: IC2.14 5.88,21.3 v6.1,20.83 5.97,20.19 RN1.5
  Bottom 0.305: D4.3 6.6,22.58 v6.1,20.83 5.97,20.19 RN2.4
N$45  (via drill 0.6)
  Top 0.305: IC2.16 7.18,23.04 v7.87,22.1 8,21.72 RN3.8
  Bottom 0.305: D5.2 7.62,23.55 v7.87,22.1 8,21.72 RN4.1
N$46
  Bottom 0.406: RN4.8 8,11.81 10.67,9.14 10.67,5.08 SV1.36
N$47  (via drill 0.6)
  Top 0.305: IC2.19 9.13,24.9 10.67,23.37 v10.67,21.08 10.54,21.21 RN3.6
  Bottom 0.305: v10.67,21.08 10.92,22.43 D6.2 10.74,17.78 RN4.3
N$48  (via drill 0.6)
  Top 0.305: IC2.20 9.78,25.52 11.94,22.86 v11.94,21.34 11.81,20.95 RN3.5
  Bottom 0.305: D6.3 12.67,21.87 v11.94,21.34 11.81,20.95 RN4.4
N$49  (via drill 0.6)
  Top 0.305: IC2.10 3.93,29.59 1.78,27.43 v1.78,22.35 2.16,21.97 RN1.8
  Bottom 0.305: v1.78,22.35 1.78,23.44 D3.2 1.6,18.14 RN2.1
N$50
  Bottom 0.406: RN2.5 5.97,11.81 9.4,8.38 SV1.37
N$51
  Bottom 0.406: RN2.6 4.7,11.81 8.13,8.38 8.13,5.08 SV1.38
N$52  (via drill 0.6)
  Top 0.305: IC2.17 7.83,23.92 v9.4,22.35 9.27,22.23 RN3.7
  Bottom 0.305: D5.3 9.4,23.39 v9.4,22.35 9.27,22.23 RN4.2
N$53
  Bottom 0.406: RN2.7 3.43,11.81 6.86,8.38 SV1.39
N$54
  Top 0.406: IC6.11 27.18,8.89 28.45,7.62 28.45,5.08 SV1.22
N$55  (via drill 0.6)
  Top 0.305: IC1.11 15.36,22.74 v15.49,22.35 15.37,21.97 RN5.7
  Bottom 0.305: D2.3 15.75,23.6 v15.49,22.35 15.37,21.97 RN6.2
N$56  (via drill 0.6)
  Top 0.305: IC1.12 16.01,24.12 16.76,23.37 v16.76,20.83 16.64,20.7 RN5.6
  Bottom 0.305: D7.2 16.76,22.53 v16.76,20.83 16.64,20.7 RN6.3
N$57  (via drill 0.6)
  Top 0.305: IC1.14 17.31,24.6 18.8,23.11 v18.8,20.83 17.91,19.94 RN5.5
  Bottom 0.305: D7.3 18.8,22.58 v18.8,20.83 17.91,19.94 RN6.4
N$58  (via drill 0.6)
  Top 0.305: IC1.16 18.61,24.9 D8.2 19.89,22.78 v20.07,22.35 19.69,22.23 RN7.8
  Bottom 0.305: D8.2 20.07,23.44 v20.07,22.35 19.69,22.23 RN8.1
N$59  (via drill 0.6)
  Top 0.305: IC1.19 20.56,25.16 21.84,23.88 22.35,23.88 22.86,23.37 v22.86,20.83 22.23,20.19 RN7.6
  Bottom 0.305: D9.2 22.86,22.53 v22.86,20.83 22.23,20.19 RN8.3
N$60  (via drill 0.6)
  Top 0.305: IC1.20 21.21,25.52 22.1,24.64 23.37,24.64 24.38,23.62 v24.38,21.08 24.38,20.07 23.49,19.18 RN7.5
  Bottom 0.305: D9.3 24.38,22.12 v24.38,21.08 24.38,20.07 23.49,19.18 RN8.4
N$61  (via drill 0.6)
  Top 0.305: IC1.10 15.36,30.09 v13.97,28.7 | v13.72,26.67 13.72,22.61 v13.97,22.35 14.1,22.23 RN5.8
  Bottom 0.305: v13.97,28.7 13.97,26.92 v13.72,26.67 | D2.2 v13.97,22.35 14.1,22.23 RN6.1
N$62  (via drill 0.6)
  Top 0.305: IC1.17 19.26,25.19 21.59,22.86 v21.59,22.35 20.95,21.97 RN7.7
  Bottom 0.305: D8.3 21.59,23.39 v21.59,22.35 20.95,21.97 RN8.2
N$63
  Bottom 0.406: RN8.5 23.49,10.54 24.64,9.4 SV1.25
N$64
  Bottom 0.406: RN8.6 22.23,10.54 23.37,9.4 23.37,5.08 SV1.26
N$65
  Bottom 0.406: RN8.7 20.95,10.54 22.1,9.4 SV1.27
N$66
  Bottom 0.406: RN8.8 19.69,10.54 20.83,9.4 20.83,5.08 SV1.28
N$67
  Bottom 0.406: RN6.5 17.91,11.05 19.56,9.4 SV1.29
N$68
  Bottom 0.406: RN6.6 16.64,11.05 18.29,9.4 18.29,5.08 SV1.30
N$69
  Bottom 0.406: RN6.7 15.37,11.05 17.02,9.4 SV1.31
N$70
  Bottom 0.406: RN6.8 14.1,11.05 15.75,9.4 15.75,5.08 SV1.32
N$71
  Top 0.406: IC8.1 69.09,29.84 Q2.2
N$72
  Top 0.406: IC8.2 67.28,30.99 68.45,30.99 Q2.1
N$73
  Bottom 0.406: D11.A 65.53,25.02 G1.+
N$74  (via drill 0.5 pad 0.25)
  Top 0.406: IC8.8 60.73,29.97 59.69,29.97 57.91,31.75 57.91,35.31 58.42,35.81 60.96,35.81 61.47,35.56 C10.1 63.16,36.66 v62.99,36.83 | R6.2 v69.34,36.83 69.34,35.81 69.85,35.31 71.88,35.31 73.15,34.04 D11.C D10.C
  Bottom 0.406: v62.99,36.83 63.75,36.83 65.53,35.05 68.58,35.05 69.34,35.81 v69.34,36.83
N$75
  Top 0.406: R6.1 72.52,38.3 C12.+ 72.39,40 72.39,39.88 C13.+
N$76
  Top 0.406: TP1.TP 54.86,29.97 55.75,29.08 IC5.15
N$77  (via drill 0.5 pad 0.25)
  Top 0.406: RN10.4 54.36,11.36 v54.36,12.7 54.48,13.34 IC5.1
  Bottom 0.406: D12.2 52.91,14.07 RN9.5 54.48,12.57 v54.36,12.7
N$78  (via drill 0.5 pad 0.25)
  Top 0.406: RN10.3 55.63,11.36 v55.63,12.7 55.75,13.34 IC5.2
  Bottom 0.406: D12.3 54.84,13.99 v55.63,12.7 | v55.63,12.7 55.63,12.63 RN9.6 55.75,12.57 v55.63,12.7
N$79
  Top 0.305: IC3.9 29.98,33.28 29.98,33.53 29.97,34.29 29.72,34.54 16.26,34.54 16,34.29 | 40.13,34.54 40.13,32.07 IC4.9 | IC1.9 16.01,32.78 16,34.29 | IC2.9 4.58,33.03 5.84,34.29 16,34.29
  Top 0.406: 29.97,34.29 33.91,34.29 34.54,34.54 40.13,34.54 | IC4.9 40.14,34.28 40.13,34.54 | 40.13,34.54 43.43,34.54 44.2,35.31 45.08,35.31 47.5,32.89 47.5,31.24 51.56,27.18 51.56,21.08 52.32,20.32 61.47,20.32 62.23,19.56 62.23,18.39 IC5.7 | SJ3.2 27.18,31.5 28.19,32.51 28.19,33.02 28.7,33.27 29.98,33.27 29.98,33.53
N$80  (via drill 0.5 pad 0.25)
  Top 0.406: RN10.2 56.9,11.36 v56.9,12.7 57.02,13.34 IC5.3
  Bottom 0.406: D13.2 56.72,12.8 RN9.7 57.02,12.57 v56.9,12.7
N$81  (via drill 0.5 pad 0.25)
  Top 0.406: RN10.1 58.17,11.36 v58.17,12.7 58.29,13.34 IC5.4
  Bottom 0.406: D13.3 58.65,12.86 RN9.8 58.29,12.57 v58.17,12.7
N$82
  Bottom 0.406: SJ1.3 35.05,50.55 35.05,53.09 33.53,53.09 U$1.26
N$83
  Bottom 0.406: SJ1.1 36.58,53.59 36.58,55.12 30.99,55.12 U$1.24
N$84
  Bottom 0.406: U$1.18 24.64,53.34 24.64,49.53 25.4,48.77 34.04,48.77 35.05,47.75 35.05,46.23 35.56,45.47 SJ2.1
N$85
  Top 0.406: IC6.12 28.45,9.14 29.72,7.87 SV1.21
N$86
  Top 0.406: IC6.13 29.72,9.4 30.99,8.13 30.99,5.08 SV1.20
N$87
  Top 0.61: RN10.5 54.36,8.96 54.36,8.38 52.58,6.6 SV1.3
N$88
  Top 0.61: RN10.6 55.63,8.96 55.63,6.86 SV1.1
N$89
  Top 0.61: RN10.7 57.15,8.96 57.15,5.33 55.63,3.81 SV1.2
N$90
  Top 0.61: RN10.8 58.42,8.96 58.42,4.57 56.39,2.54 53.85,2.54 SV1.4
N$91
  Top 0.406: 30.99,9.4 32.26,8.13 SV1.19
  Top 0.61: 30.99,9.4 IC6.14
N$92
  Top 0.406: IC6.15 32.26,9.4 33.53,8.13 33.53,5.08 SV1.18
N$93
  Top 0.406: IC6.16 33.53,9.4 34.8,8.13 SV1.17
N$94
  Top 0.406: IC6.17 34.8,9.65 36.07,8.38 36.07,5.08 SV1.16
N$95
  Top 0.406: IC6.18 36.07,10.16 37.34,8.89 SV1.15
N$96
  Bottom 0.406: RN2.8 2.16,11.81 5.59,8.38 5.59,5.08 SV1.40
N$97
  Top 0.406: IC7.11 39.88,9.14 38.61,7.87 38.61,5.08 SV1.14
N$98
  Top 0.406: IC7.12 41.15,8.89 39.88,7.62 SV1.13
N$99
  Top 0.406: IC7.13 42.42,8.89 41.15,7.62 41.15,5.08 SV1.12
N$100
  Top 0.406: IC7.14 43.69,8.64 42.42,7.37 SV1.11
N$101
  Top 0.406: IC7.15 44.96,8.64 43.69,7.37 43.69,5.08 SV1.10
N$102
  Top 0.406: IC7.16 46.23,8.64 44.96,7.37 SV1.9
N$103
  Top 0.406: IC7.17 47.5,8.38 46.23,7.11 46.23,5.08 SV1.8
N$104
  Top 0.406: IC7.18 48.77,7.62 SV1.7
N$105  (via drill 0.6)
  Top 0.406: U2.17 v29.72,47.5
  Bottom 0.406: v29.72,47.5 29.72,45.59 30.48,44.7 30.48,43.88 R10.1
N$107
  Top 0.406: R15.1 R16.2 23.68,43.11 22.35,41.78 U$2.3
N$108
  Top 0.406: U$2.4 21.08,43.11 R14.1
N$110
  Top 0.406: U$2.5 14.48,43.05 12.7,44.83 R12.1 R11.2
N$112  (via drill 0.6)
  Top 0.61: R13.1 v14.99,44.7 | v13.21,42.55 13.46,42.29 13.84,42.29 14.35,41.78 U$2.6
  Top 1.27: C16.2 16.32,45.73 R13.1
  Bottom 0.61: v14.99,44.7 13.21,42.8 v13.21,42.55
N$115
  Top 1.27: C15.2 18.6,45.09 R13.2
N$118
  Top 0.61: 20.95,37.97 20.95,39.06 U$2.1
  Top 1.27: C14.1 20.57,37.59 20.95,37.97
N$119
  Top 0.61: U$2.8 15.94,38.55 15.88,38.48
  Top 1.27: 15.88,38.48 15.88,38.23 16,38.1 | 16,38.1 16.51,37.59 C14.2 | 16,38.1 14.56,36.66 D14.C 9.2,36.03 L1.1
VDD  (via drill 0.5, 0.5 pad 0.25)
  Top 0.305: 57.28,43.81 U1.3
  Top 0.406: U1.3 55.1,43.6 C4.1 | 57.28,43.81 59.44,45.72 59.44,46.99 60.96,48.51 61.98,48.51 62.48,48.01 62.48,47.5 63.25,46.74 63.82,46.74 R3.2
  Top 0.61: C4.1 v53.34,42.16 | v33.66,41.53 29.46,41.53 24.77,36.83 v22.23,36.83 | v9.02,45.59 9.02,48.13
  Top 1.016: TP2.TP 5.2,42.8 C17.2
  Top 1.27: R11.1 10.09,48.19 9.02,48.13 5.59,48.13 | 5.59,48.13 5.59,42.55 C17.2 5.46,41.91 4.7,41.15 4.7,37.99 L1.2 | U$1.2 2.16,53.34 1.27,52.45 1.27,48.9 2.03,48.13 5.59,48.13
  Bottom 0.61: v53.34,42.16 52.83,42.42 34.54,42.42 v33.66,41.53 | v22.23,36.83 12.83,36.83 9.02,40.77 v9.02,45.59
VSS  (via drill 0.5, 0.5 pad 0.25, 0.6)
  Top 0.305: IC4.15 42.09,27.87 42.67,28.45 46.14,28.45 C6.2 | C8.2 7.41,28.11 | 7.41,28.11 7.24,28.07 | 7.18,28 6.6,27.43 6.6,26.43 IC2.15 | IC2.7 5.88,31.54 5.84,31.5 5.84,33.02 6.6,33.02 6.6,32.13 IC2.6 6.53,29.36 7.41,28.11 | IC1.7 17.31,28.66 18.03,27.69 | 18.03,27.69 18.03,26.43 IC1.15 | C9.2 18.71,28.36 18.03,27.69 | IC3.6 31.93,30.04 33.15,28.83 | 33.15,28.83 33.53,28.45 35.98,28.45 C7.2 | IC3.15 31.93,27.61 33.15,28.83 | X1.1 69.57,53.34 LED2.C LED3.C LED1.C 62.48,53.82 62.48,51.56 59.69,49.28 | 58.42,47.98 58.42,45.72 57.91,45.21 56.26,45.09 U1.2 55.1,45.3 C4.2 | R5.2 50.87,39.69 52.58,41.15 v54.61,41.15 | RN1.1 RN1.2 RN1.3 RN1.4 6.98,14.17 RN3.1 RN3.2 RN3.3 RN3.4 11.87,14.22 12.95,14.22 13.97,14.22 14.02,14.17 RN5.1 RN5.2 RN5.3 RN5.4 RN7.1 RN7.2 RN7.3 RN7.4 25.09,14.17 25.91,14.99 25.91,16.89 IC6.9
  Top 0.406: 50.8,37.59 50.8,36.2 50.8,35.31 49.53,33.91 G1.- 55.37,31.75 | 50.8,37.59 50.8,38.03 R5.2 50.87,37.66 50.8,37.59 | C12.- 70.1,38.1 67.82,40.39 66.8,40.39 C13.- 65.02,39.12 65.02,35.73 C10.2 | C10.2 64.86,34.96 66.29,33.53 67.05,33.53 IC8.4 | IC5.12 59.56,28.83 | 59.56,28.83 59.44,28.96 58.42,28.96 58.17,28.7 58.17,27.59 IC5.13 58.29,25.02 55.12,21.84 52.74,21.84 C5.2 57.91,22.01 61.05,22.01 63.5,19.56 63.5,18.39 IC5.8 63.37,16.89 62.99,16.51 61.47,16.51 60.96,17.02 60.96,18.13 IC5.6 60.83,16.89 60.2,16.26 v59.69,16.26 59.56,16.38 IC5.5 59.69,18.39 | 59.56,28.83 58.29,28.83 55.37,31.75 | C10.2 64.86,36.74 63.75,37.85 58.67,37.85 55.37,34.54 55.37,31.75 | C7.2 37.25,28.36 v37.34,28.45 37.47,28.45 38.48,29.46 38.48,30.99 v37.85,31.62 | C6.2 46.32,28.45 v47.5,28.45 47.5,26.16 v50.29,23.11 | IC7.9 38.61,22.61 38.35,22.86 v37.59,23.11 | IC6.9 v25.91,23.37 26.16,23.37 SJ3.3 24.55,28.36 C9.2 | IC2.15 6.53,27.36 7.18,28 7.24,28.07 12.7,28.07 13.46,27.69 18.03,27.69 | U1.5 62.23,41.84 v62.23,41.4 | 59.69,49.28 v57.4,49.28 58.42,48.26 58.42,47.98 | 44.7,37.85 v44.7,39.62
  Top 0.61: U1.8 61.53,47.18 v61.47,47.5 | 13.84,40.51 U$2.7 | U$1.6 8.13,53.47 9.52,54.86 11.3,54.86 11.94,54.23 11.94,49.78 12.57,49.15 12.57,48.32 R12.2 | IC7.9 38.61,19.18 40.51,17.27 v42.42,17.27 | v27.18,17.02 26.03,17.02 25.91,16.89 | v57.91,22.86 57.91,22.01 | v57.91,39.12 57.91,38.61 58.67,37.85 | v26.03,35.43 38.61,35.43 | 38.61,35.43 41.02,35.43 41.78,36.2 44.58,36.2 | 44.58,36.2 50.8,36.2 | 44.7,37.85 44.58,37.72 44.58,36.2 | U2.9 38.61,35.43 | v12.95,19.05 12.95,14.22 | v6.86,19.05 6.98,18.92 6.98,14.17 | v24.89,27.18 24.55,27.52 24.55,28.36 | v2.29,3.81 0.89,5.21 0.89,13.59 1.47,14.17 RN1.1
  Top 1.016: v5.33,28.57 6.6,28.57 7.18,28
  Top 1.27: v27.05,40.89 26.54,41.4 26.54,45.97 25.91,46.61 24.7,46.61 R15.2 R14.2 21.08,47.5 20.45,48.13 20.32,48.13 20.19,48.26 18.22,48.26 C15.1 C16.1 15.3,48.32 | C17.1 v10.41,42.55 | v10.41,42.55 10.45,42.55 D14.A 13.55,40.55 13.84,40.51 | v10.41,42.55 10.54,42.42 | 15.3,48.32 14.48,47.5 v14.48,46.74 | R12.2 13.08,48.32 15.3,48.32
  Bottom 0.305: v54.61,41.15 54.61,48.77 55.12,49.28 v57.4,49.28
  Bottom 0.406: D12.1 D13.1 v59.69,16.26 59.69,11.18 59.64,10.36 RN9.1 RN9.2 RN9.3 RN9.4 51.25,9.09 50.04,7.87 SV1.5 SV1.6 | v37.34,28.45 v47.5,28.45 | 53.59,22.9 53.25,23.11 v50.29,23.11 v37.59,23.11 26.42,23.11 26.16,23.37 v25.91,23.37 25.91,24.64 D9.1 23.14,25.63 21.84,25.65 D8.1 17.27,25.65 | 17.27,25.65 D2.1 11.18,25.65 | D7.1 17.8,25.68 17.27,25.65 | 11.18,25.65 D5.1 5.59,25.65 | D6.1 11.71,25.63 11.18,25.65 | D4.1 5.61,25.63 5.59,25.65 | D3.1 5.59,25.65 | v62.23,41.4 62.99,40.64 C13.- | C2.2 44.7,37.85 | 44.7,37.85 C3.2 | v44.7,39.62 44.7,37.85
  Bottom 0.61: v61.47,47.5 59.69,49.28 v57.4,49.28 | 29.08,40.26 28.49,40.26 C1.2 27.39,40.55 v27.05,40.89 26.29,41.66 23.62,41.66 22.61,40.64 22.61,38.86 v26.03,35.43 | v53.34,48.77 54.61,48.77 | 53.59,22.9 55.21,22.86 v57.91,22.86 | v61.98,2.79 61.98,8.02 59.64,10.36
  Bottom 1.016: TP4.TP 1.52,32.38 v5.33,28.57
  Bottom 1.27: C18.1 29.08,40.26 | v14.48,46.74 14.6,46.74 v10.41,42.55
  other vias: 22.86,46.61 1.52,32.51 56.64,31.75 1.4,46.74 64.26,39.12 61.85,51.94 30.73,1.65 64.9,28.32
  pour Bottom (isolate 0.254): 0,55.88 0,0 64.26,0.25 64.26,18.03 75.95,18.03 75.95,55.88 51.82,55.88 51.82,43.43 40.64,43.43 40.64,55.88
  pour Top: 0,55.88 0,0 64.52,0 64.52,18.03 75.95,18.03 75.95,55.88 51.82,55.88 51.82,43.43 40.64,43.43 40.64,55.88

### Text on the board
tPlace: CANoPi | V1.0 | 5 | 3 | 0 | 24